# Altium schematic sheet MCU.SchDoc
size A3
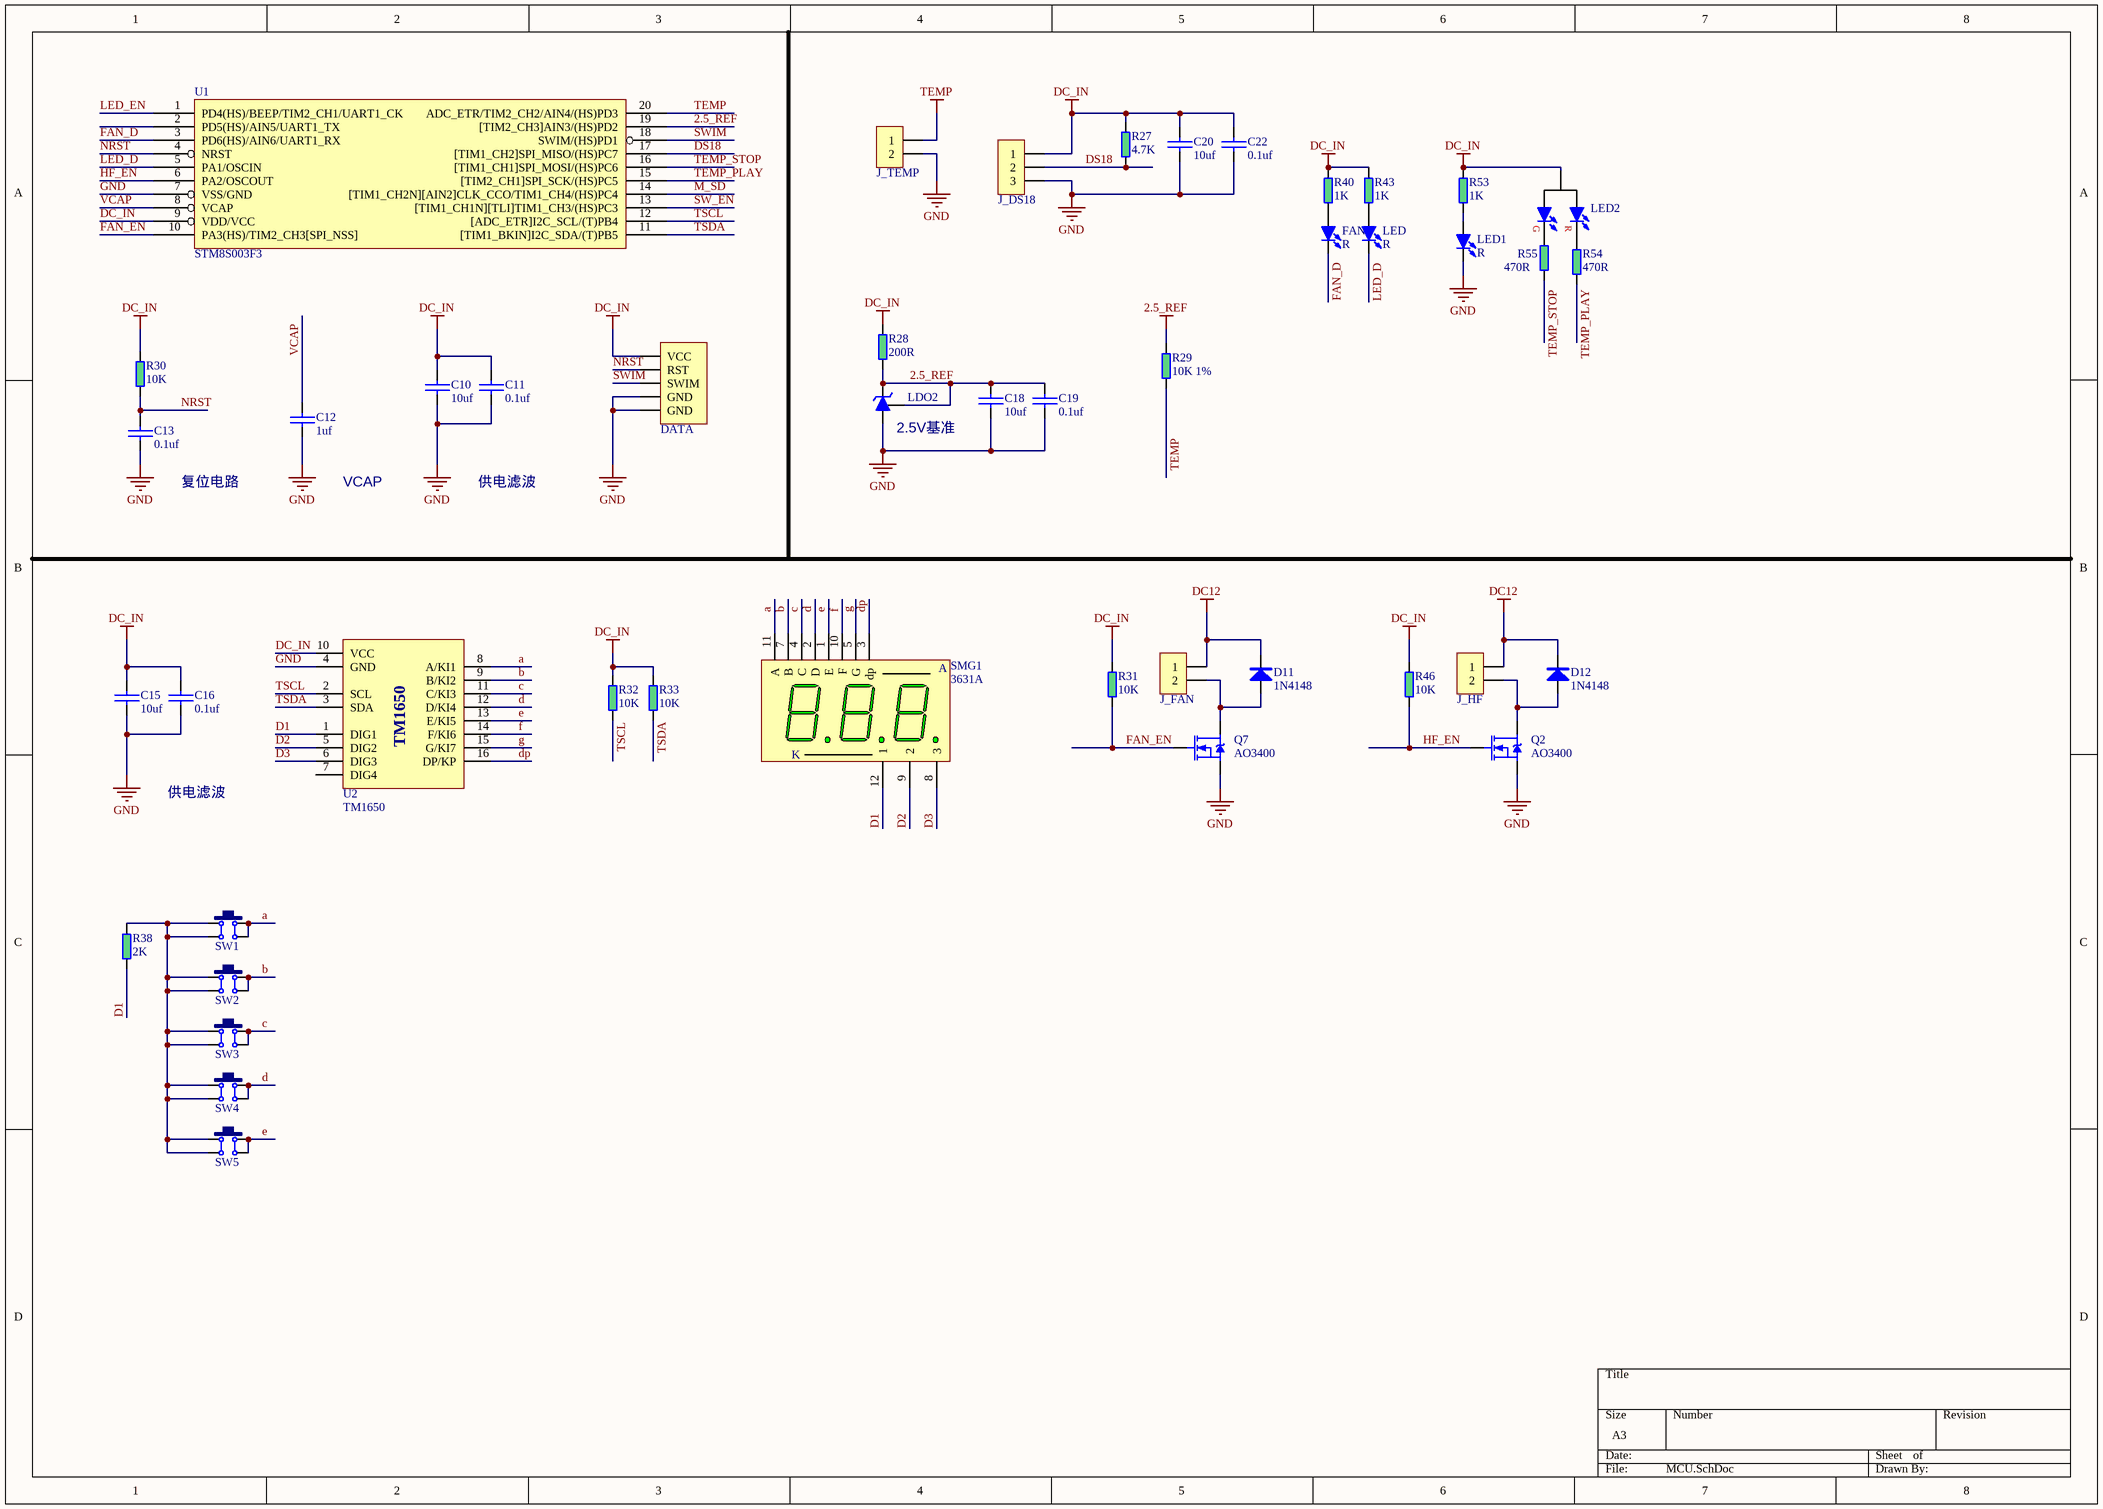
[diagram p0: MCU.SchDoc]

## Parts
C10  value 10uf  [C 0603]  (hidden comment: 04.Cap)
C11  value 0.1uf  [C 0603]  (hidden comment: 04.Cap)
C12  value 1uf  [C 0603]  (hidden comment: 04.Cap)
C13  value 0.1uf  [C 0603]  (hidden comment: 04.Cap)
C15  value 10uf  [C 0603]  (hidden comment: 04.Cap)
C16  value 0.1uf  [C 0603]  (hidden comment: 04.Cap)
C18  value 10uf  [C 0603]  (hidden comment: 04.Cap)
C19  value 0.1uf  [C 0603]  (hidden comment: 04.Cap)
C20  value 10uf  [C 0603]  (hidden comment: 04.Cap)
C22  value 0.1uf  [C 0603]  (hidden comment: 04.Cap)
D11  1N4148  [D 1N4148-LL34]
D12  1N4148  [D 1N4148-LL34]
DATA  WR_STM-SWIM  [MCU_WRITE]  (value not drawn)
FAN  R  [LED 0603B]
J_DS18  Pin03  [XH2.54 3P]  (value not drawn)
J_FAN  Pin02  [XH2.54 2P]  (value not drawn)
J_HF  Pin02  [XH2.54 2P]  (value not drawn)
J_TEMP  Pin02  [XH2.54 2P]  (value not drawn)
LDO2  TL431  [P TL431-SOT23]  (value not drawn)
LED  R  [LED 0603B]
LED1  R  [LED 3mm R]
LED2  15.Diode - PLED - double  [LED 3mm R/G]  (value not drawn)
Q2  AO3400  [FET-AO3400-SOT23]
Q7  AO3400  [FET-AO3400-SOT23]
R27  4.7K  [R 0603]
R28  200R  [R 0603]
R29  10K 1%  [R 0805]
R30  10K  [R 0603]
R31  10K  [R 0603]
R32  10K  [R 0603]
R33  10K  [R 0603]
R38  2K  [R 0603]
R40  1K  [R 0603]
R43  1K  [R 0603]
R46  10K  [R 0603]
R53  1K  [R 0603]
R54  470R  [R 0603]
R55  470R  [R 0603]
SMG1  3631A  [SMG 0.36-3P]
SW1  TSW DIP-6x6  [TSW DIP-6*6]  (value not drawn)
SW2  TSW DIP-6x6  [TSW DIP-6*6]  (value not drawn)
SW3  TSW DIP-6x6  [TSW DIP-6*6]  (value not drawn)
SW4  TSW DIP-6x6  [TSW DIP-6*6]  (value not drawn)
SW5  TSW DIP-6x6  [TSW DIP-6*6]  (value not drawn)
U1  STM8S003F3  [TSSOP20]
U2  TM1650  [SOP16]

## Nets
2.5_REF: C18.1 C19.1 LDO2.K LDO2.R R28.1 R29.2 U1.19([TIM2_CH3]AIN3/(HS)PD2)
DC12: D11.K D12.K J_FAN.1 J_HF.1
DC_IN: C10.1 C11.1 C15.1 C16.1 C20.1 C22.1 DATA.1(VCC) J_DS18.1 LED2.A R27.2 R28.2 R30.2 R31.2 R32.2 R33.2 R40.2 R43.2 R46.2 R53.2 U1.9(VDD/VCC) U2.10(VCC)
GND: C10.2 C11.2 C12.2 C13.2 C15.2 C16.2 C18.2 C19.2 C20.2 C22.2 DATA.4(GND) DATA.5(GND) J_DS18.3 J_TEMP.2 LDO2.A LED1.K Q2.S Q7.S U1.7(VSS/GND) U2.4(GND)
TEMP: J_TEMP.1 R29.1 U1.20(ADC_ETR/TIM2_CH2/AIN4/(HS)PD3)
a: SMG1.11(A) SW1.C SW1.D U2.8(A/KI1)
b: SMG1.7(B) SW2.C SW2.D U2.9(B/KI2)
c: SMG1.4(C) SW3.C SW3.D U2.11(C/KI3)
d: SMG1.2(D) SW4.C SW4.D U2.12(D/KI4)
D1: R38.1 SMG1.12(1) U2.1(DIG1)
D2: SMG1.9(2) U2.5(DIG2)
D3: SMG1.8(3) U2.6(DIG3)
dp: SMG1.3(dp) U2.16(DP/KP)
DS18: J_DS18.2 R27.1 U1.17([TIM1_CH2]SPI_MISO/(HS)PC7)
e: SMG1.1(E) SW5.C SW5.D U2.13(E/KI5)
f: SMG1.10(F) U2.14(F/KI6)
FAN_D: FAN.K U1.3(PD6(HS)/AIN6/UART1_RX)
FAN_EN: Q7.G R31.1 U1.10(PA3(HS)/TIM2_CH3[SPI_NSS])
g: SMG1.5(G) U2.15(G/KI7)
HF_EN: Q2.G R46.1 U1.6(PA2/OSCOUT)
LED_D: LED.K U1.5(PA1/OSCIN)
LED_EN: U1.1(PD4(HS)/BEEP/TIM2_CH1/UART1_CK)
M_SD: U1.14([TIM1_CH2N][AIN2]CLK_CCO/TIM1_CH4/(HS)PC4)
NRST: C13.1 DATA.2(RST) R30.1 U1.4(NRST)
SW_EN: U1.13([TIM1_CH1N][TLI]TIM1_CH3/(HS)PC3)
SWIM: DATA.3(SWIM) U1.18(SWIM/(HS)PD1)
TEMP_PLAY: R54.1 U1.15([TIM2_CH1]SPI_SCK/(HS)PC5)
TEMP_STOP: R55.1 U1.16([TIM1_CH1]SPI_MOSI/(HS)PC6)
TSCL: R32.1 U1.12([ADC_ETR]I2C_SCL/(T)PB4) U2.2(SCL)
TSDA: R33.1 U1.11([TIM1_BKIN]I2C_SDA/(T)PB5) U2.3(SDA)
VCAP: C12.1 U1.8(VCAP)
NetD11_A: D11.A J_FAN.2 Q7.D
NetD12_A: D12.A J_HF.2 Q2.D
NetFAN_A: FAN.A R40.1
NetLED1_A: LED1.A R53.1
NetLED2_G: LED2.G R55.2
NetLED2_R: LED2.R R54.2
NetLED_A: LED.A R43.1
NetR38_2: R38.2 SW1.A SW1.B SW2.A SW2.B SW3.A SW3.B SW4.A SW4.B SW5.A SW5.B

Not connected (* = marked no-connect by the designer): U1 2(PD5(HS)/AIN5/UART1_TX); U2 7(DIG4)

## Notes on the sheet
- (near LDO2) 2.5V基准
- (near C13) 复位电路
- VCAP
- 供电滤波
- (in symbol 3631A) K

## Library data of the parts
C10-C13 C15 C16 C18-C20 C22 = 04.Cap: 电容
D11 D12 = 12.Diode: 二极管
FAN LED LED1 = 15.Diode - LED: LED
LDO2 = TL431: 电压基准（out=Ref*(1+R1/R2)）
Q2 Q7 = 09.FET(N): MOS管 NPN
R27-R33 R38 R40 R43 R46 R53-R55 = 01.Res: 电阻
SMG1 = 3631A: 0.36寸3位共阴数码管; 版权归属: 源创客; BOM名称: 0.36寸3位共阴; 学习资源: www.ooocke.com
SW1-SW5 = TSW DIP-6x6: 6x6轻触开关; BOM名称: 6x6轻触开关
U1 = STM8S003F3P6 - TSSOP20
U2 = TM1650: 数码管驱动芯片